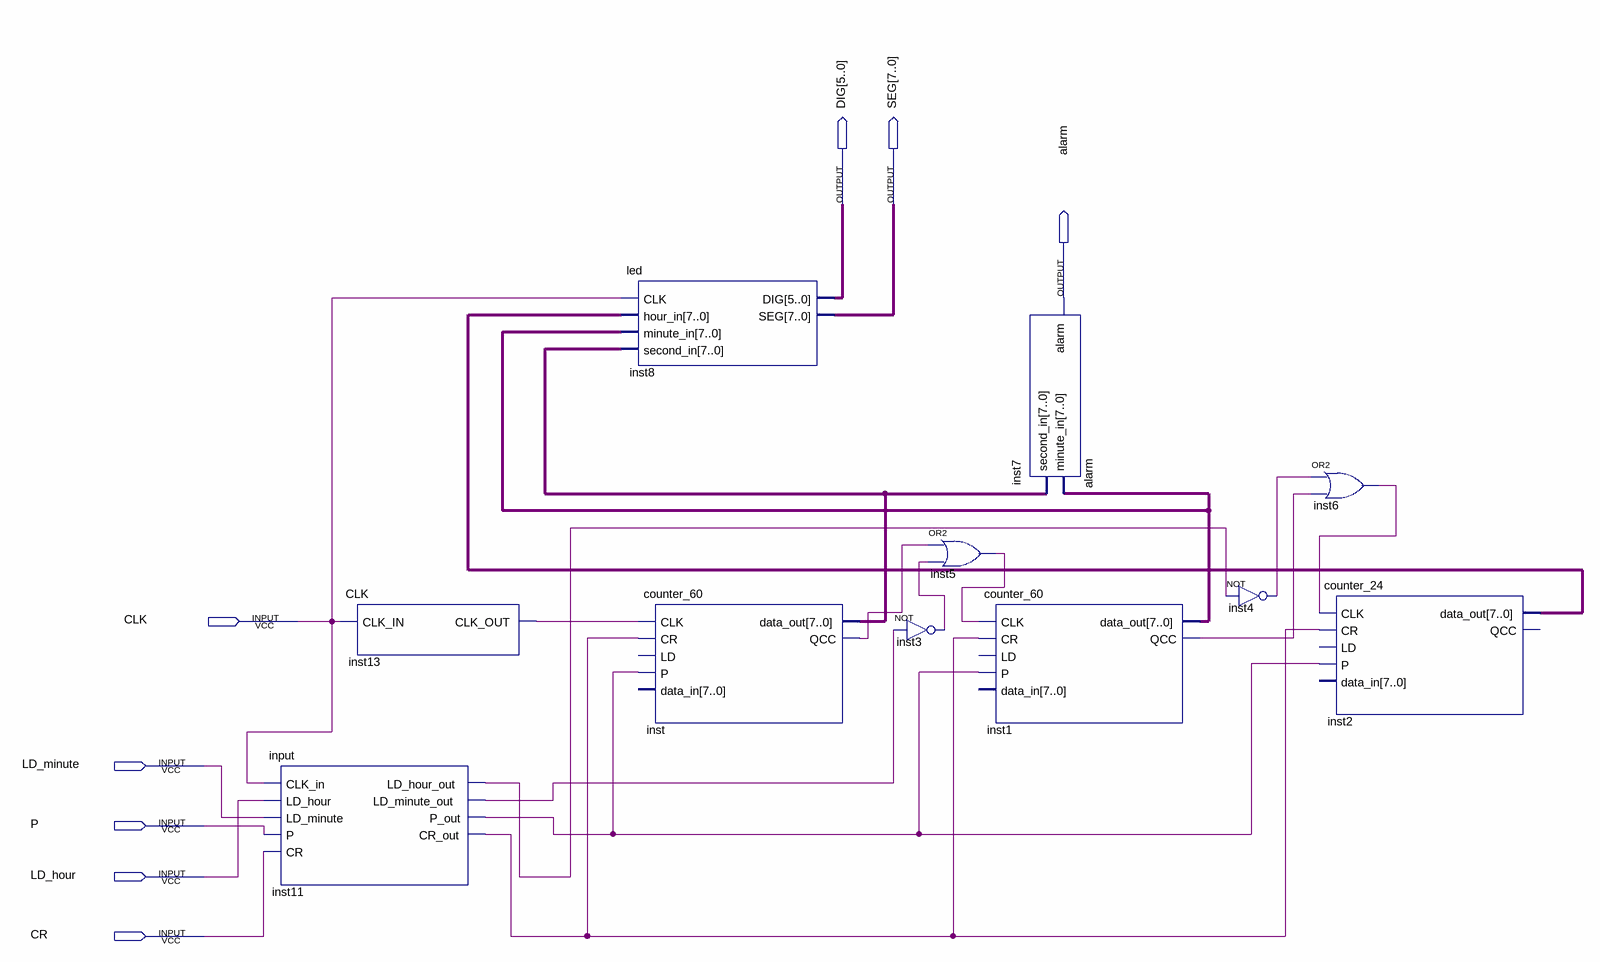
[diagram p0: schematic sheet]
// Quartus schematic clock.bdf as structural Verilog: 11 symbols, 8 pins
module clock (
  input  CLK,
  input  LD_minute,
  input  P,
  input  LD_hour,
  input  CR,
  output [5:0] DIG,
  output [7:0] SEG,
  output alarm
);

  wire inst1_qcc, inst3_out, inst4_out, inst5_out, inst6_out, inst11_cr_out, inst11_ld_hour_out,
       inst11_ld_minute_out, inst11_p_out, inst13_clk_out, inst_qcc;
  wire [7:0] inst1_data_out, inst2_data_out, inst_data_out;

  \input  inst11 (
    .CLK_in(CLK), .LD_hour(LD_hour), .LD_minute(LD_minute), .P(P), .CR(CR), .LD_hour_out(inst11_ld_hour_out),
    .LD_minute_out(inst11_ld_minute_out), .P_out(inst11_p_out), .CR_out(inst11_cr_out));
  CLK inst13 (.CLK_IN(CLK), .CLK_OUT(inst13_clk_out));
  led inst8 (
    .CLK(CLK), .hour_in(inst2_data_out), .minute_in(inst1_data_out), .second_in(inst_data_out), .DIG(DIG),
    .SEG(SEG));
  counter_60 inst (
    .CLK(inst13_clk_out), .CR(inst11_cr_out), .P(inst11_p_out), .data_out(inst_data_out), .QCC(inst_qcc));  // open: LD, data_in
  not inst3 (inst3_out, inst11_ld_minute_out);
  or inst5 (inst5_out, inst_qcc, inst3_out);
  counter_60 inst1 (
    .CLK(inst5_out), .CR(inst11_cr_out), .P(inst11_p_out), .data_out(inst1_data_out), .QCC(inst1_qcc));  // open: LD, data_in
  alarm inst7 (.minute_in(inst1_data_out), .second_in(inst_data_out), .alarm(alarm));
  not inst4 (inst4_out, inst11_ld_hour_out);
  or inst6 (inst6_out, inst4_out, inst1_qcc);
  counter_24 inst2 (
    .CLK(inst6_out), .CR(inst11_cr_out), .P(inst11_p_out), .data_out(inst2_data_out));  // open: LD, data_in, QCC
endmodule
